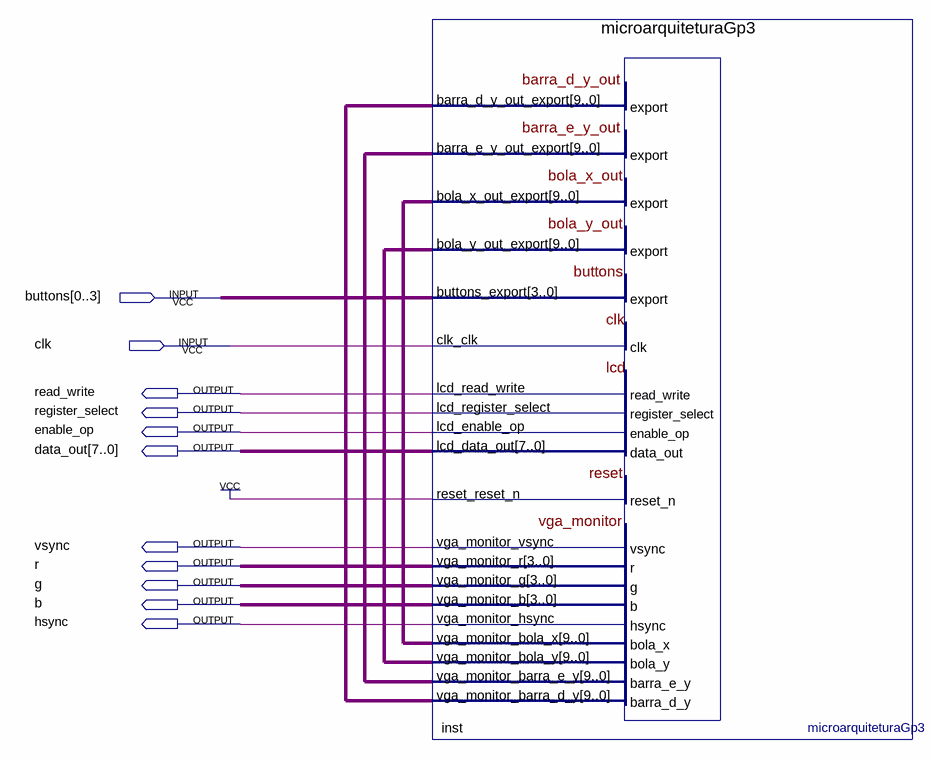
[diagram p0: schematic sheet]
// Quartus schematic pong.bdf as structural Verilog: 1 symbols, 11 pins
module pong (
  input  [0:3] buttons,
  input  clk,
  output read_write,
  output register_select,
  output enable_op,
  output [7:0] data_out,
  output vsync,
  output r,
  output g,
  output b,
  output hsync
);

  wire [3:0] inst_vga_monitor_b, inst_vga_monitor_g, inst_vga_monitor_r;
  wire [9:0] inst_barra_d_y_out_export, inst_barra_e_y_out_export, inst_bola_x_out_export,
       inst_bola_y_out_export;

  microarquiteturaGp3 inst (
    .buttons_export(buttons), .clk_clk(clk), .reset_reset_n(1'b1),
    .vga_monitor_bola_x(inst_bola_x_out_export), .vga_monitor_bola_y(inst_bola_y_out_export),
    .vga_monitor_barra_e_y(inst_barra_e_y_out_export), .vga_monitor_barra_d_y(inst_barra_d_y_out_export),
    .barra_d_y_out_export(inst_barra_d_y_out_export), .barra_e_y_out_export(inst_barra_e_y_out_export),
    .bola_x_out_export(inst_bola_x_out_export), .bola_y_out_export(inst_bola_y_out_export),
    .lcd_read_write(read_write), .lcd_register_select(register_select), .lcd_enable_op(enable_op),
    .lcd_data_out(data_out), .vga_monitor_vsync(vsync), .vga_monitor_r(inst_vga_monitor_r),
    .vga_monitor_g(inst_vga_monitor_g), .vga_monitor_b(inst_vga_monitor_b), .vga_monitor_hsync(hsync));
endmodule
